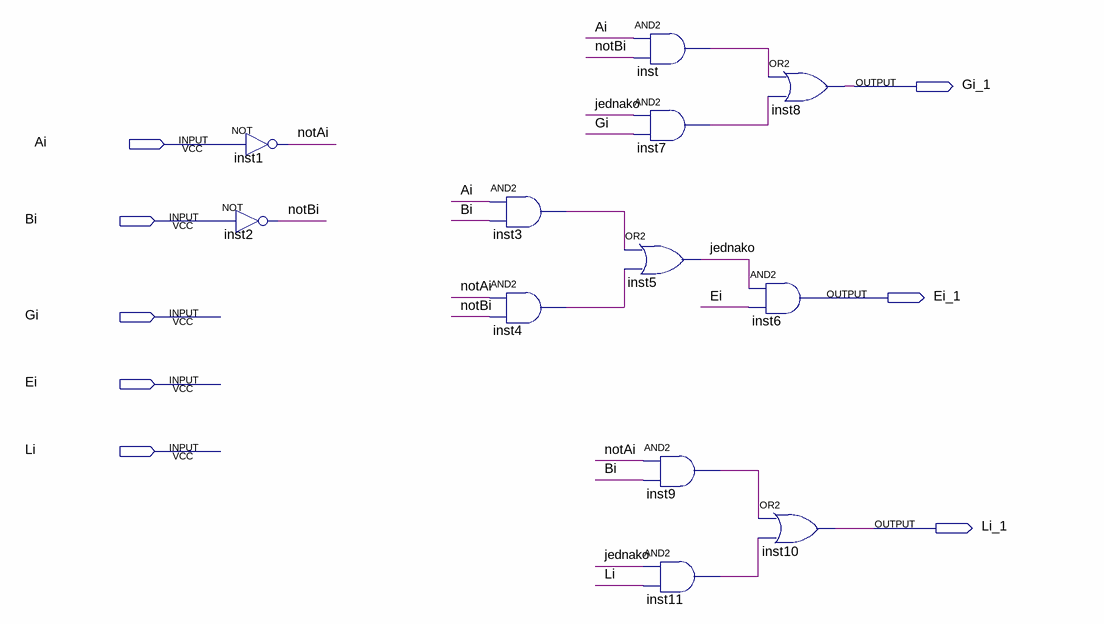
[diagram p0: schematic sheet]
// Quartus schematic cmp1.bdf as structural Verilog: 12 symbols, 8 pins
module cmp1 (
  input  Ai,
  input  Bi,
  input  Gi,
  input  Ei,
  input  Li,
  output Gi_1,
  output Ei_1,
  output Li_1
);

  wire inst3_out, inst4_out, inst7_out, inst9_out, inst11_out, inst_out, jednako, notAi, notBi;

  not inst1 (notAi, Ai);
  not inst2 (notBi, Bi);
  and inst3 (inst3_out, Ai, Bi);
  and inst4 (inst4_out, notAi, notBi);
  and inst (inst_out, Ai, notBi);
  and inst7 (inst7_out, jednako, Gi);
  or inst5 (jednako, inst3_out, inst4_out);
  and inst9 (inst9_out, notAi, Bi);
  and inst11 (inst11_out, jednako, Li);
  or inst8 (Gi_1, inst_out, inst7_out);
  and inst6 (Ei_1, jednako, Ei);
  or inst10 (Li_1, inst9_out, inst11_out);
endmodule
